# Altium schematic sheet Power5VManagement.SchDoc
size 420 x 297 mm; DocumentNumber: PowerManagement
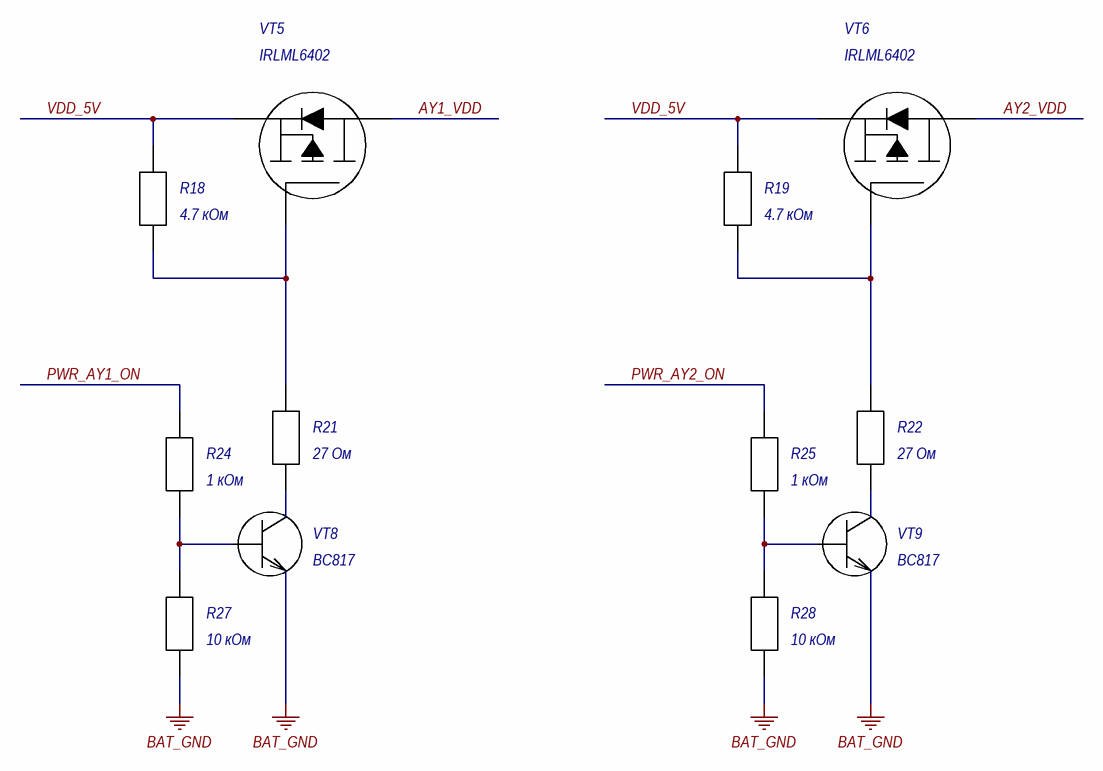
[diagram p0: Power5VManagement.SchDoc]

## Parts
R18  4.7 кОм  [RES 0402]
R19  4.7 кОм  [RES 0402]
R21  27 Ом  [RES 0402]
R22  27 Ом  [RES 0402]
R24  1 кОм  [RES 0402]
R25  1 кОм  [RES 0402]
R27  10 кОм  [RES 0402]
R28  10 кОм  [RES 0402]
VT5  IRLML6402  [SOT-23]
VT6  IRLML6402  [SOT-23]
VT8  BC817  [SOT-23]
VT9  BC817  [SOT-23]

## Nets
BAT_GND: R27.1 R28.1 VT8.2(E) VT9.2(E)
AY1_VDD: VT5.3(D)
AY2_VDD: VT6.3(D)
PWR_AY1_ON: R24.2
PWR_AY2_ON: R25.2
VDD_5V: R18.2 R19.2 VT5.2(S) VT6.2(S)
NetR18_1: R18.1 R21.2 VT5.1(G)
NetR19_1: R19.1 R22.2 VT6.1(G)
NetR21_1: R21.1 VT8.3(C)
NetR22_1: R22.1 VT9.3(C)
NetR24_1: R24.1 R27.2 VT8.1(B)
NetR25_1: R25.1 R28.2 VT9.1(B)

## Notes on the sheet
- Подп. и дата
- Инв. № дубл.
- Взам. инв. №
- Инв. № подл.
- Лист
- Изм.
- № докум.
- Подп.
- Дата
- Копировал
- Формат А3

## Library data of the parts
R18 R19 R21 R22 R24 R25 R27 R28 = RES 0402
VT8 VT9 = BC817: NPN general-purpose transistor; Manufacturer: NXP; Structure: n-p-n; Type: Транзистор биполярный; hFE: 160 ... 600; Max collector-emitter voltage: 45 В; Max collector-base voltage: 50 В; Max emitter-base voltage: 5 В; Max collector current: 0,5 А; Max collector peak current: 1 А; Power dissitipation: 0,25 Вт; fT: 100 МГц; Collector-emitter saturation voltage: 0,7 В; Base-emitter on voltage: 1,2 В; Specitication: ЭКБ ИП; Collector-base сapacitance: 3 пФ; Complement: BC807; Temperature range: -65 ... 150 °C